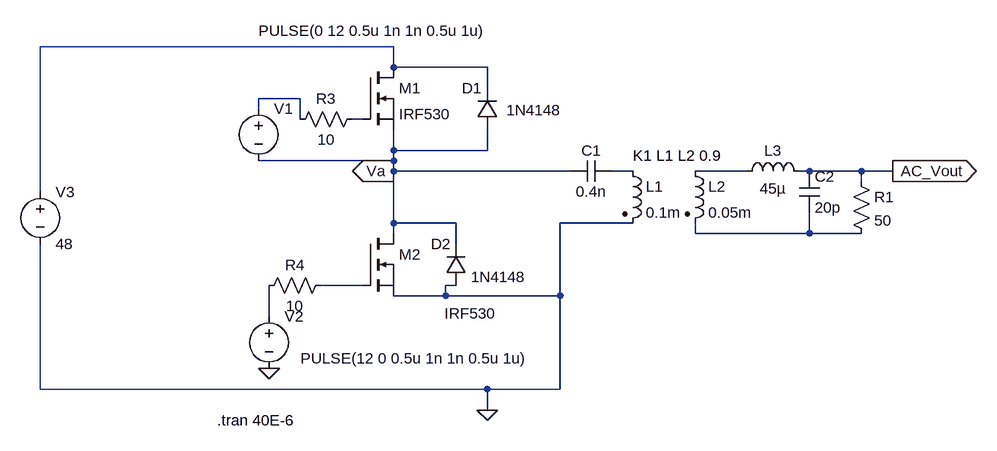
[diagram p0: schematic 1MHz_rezonansinverter.asc]
1MHz_rezonansinverter.asc, the LTspice schematic file:
Version 4
SHEET 1 1024 680
WIRE 96 -96 -448 -96
WIRE 96 -64 96 -96
WIRE 240 -64 96 -64
WIRE 240 -32 240 -64
WIRE -48 -16 -112 -16
WIRE -112 0 -112 -16
WIRE -48 16 -48 -16
WIRE 48 16 32 16
WIRE 96 64 96 32
WIRE 240 64 240 32
WIRE 240 64 96 64
WIRE 96 80 96 64
WIRE 96 80 -112 80
WIRE 96 96 96 80
WIRE 368 96 96 96
WIRE 464 96 432 96
WIRE 640 96 560 96
WIRE 736 96 720 96
WIRE 816 96 736 96
WIRE 864 96 816 96
WIRE 816 112 816 96
WIRE -448 128 -448 -96
WIRE 96 176 96 96
WIRE 192 176 96 176
WIRE 464 176 352 176
WIRE 96 192 96 176
WIRE 560 192 560 176
WIRE 736 192 736 160
WIRE 736 192 560 192
WIRE 816 192 736 192
WIRE 192 208 192 176
WIRE 48 272 -16 272
WIRE 192 272 176 272
WIRE 176 288 176 272
WIRE 176 288 96 288
WIRE 352 288 352 176
WIRE 352 288 176 288
WIRE -96 320 -96 272
WIRE -448 432 -448 208
WIRE 240 432 -448 432
WIRE 352 432 352 288
WIRE 352 432 240 432
WIRE 240 464 240 432
FLAG -96 400 0
FLAG 240 464 0
FLAG 864 96 AC_Vout
IOPIN 864 96 Out
FLAG 96 96 Va
IOPIN 96 96 Out
SYMBOL ind2 448 80 R0
SYMATTR InstName L1
SYMATTR Value 0.1m
SYMATTR Type ind
SYMBOL ind2 544 80 R0
SYMATTR InstName L2
SYMATTR Value 0.05m
SYMATTR Type ind
SYMBOL cap 432 80 R90
WINDOW 0 0 32 VBottom 2
WINDOW 3 32 32 VTop 2
SYMATTR InstName C1
SYMATTR Value 0.4n
SYMBOL ind 624 112 R270
WINDOW 0 32 56 VTop 2
WINDOW 3 5 56 VBottom 2
SYMATTR InstName L3
SYMATTR Value 45µ
SYMBOL cap 720 96 R0
SYMATTR InstName C2
SYMATTR Value 20p
SYMBOL res 800 96 R0
SYMATTR InstName R1
SYMATTR Value 50
SYMBOL nmos 48 -64 R0
SYMATTR InstName M1
SYMATTR Value IRF530
SYMBOL nmos 48 192 R0
WINDOW 3 126 123 Left 2
SYMATTR Value IRF530
SYMATTR InstName M2
SYMBOL voltage -112 -16 R0
WINDOW 3 0 -104 Left 2
WINDOW 123 0 0 Left 0
WINDOW 39 0 0 Left 0
SYMATTR Value PULSE(0 12 0.5u 1n 1n 0.5u 1u)
SYMATTR InstName V1
SYMBOL voltage -96 304 R0
WINDOW 3 49 80 Left 2
WINDOW 123 0 0 Left 0
WINDOW 39 0 0 Left 0
SYMATTR Value PULSE(12 0 0.5u 1n 1n 0.5u 1u)
SYMATTR InstName V2
SYMBOL voltage -448 112 R0
WINDOW 123 0 0 Left 0
WINDOW 39 0 0 Left 0
SYMATTR InstName V3
SYMATTR Value 48
SYMBOL res 48 0 R90
WINDOW 0 0 56 VBottom 2
WINDOW 3 32 56 VTop 2
SYMATTR InstName R3
SYMATTR Value 10
SYMBOL res 0 256 R90
WINDOW 0 0 56 VBottom 2
WINDOW 3 32 56 VTop 2
SYMATTR InstName R4
SYMATTR Value 10
SYMBOL diode 256 32 R180
WINDOW 0 24 64 Left 2
WINDOW 3 -98 30 Left 2
SYMATTR InstName D1
SYMATTR Value 1N4148
SYMBOL diode 208 272 R180
WINDOW 0 24 64 Left 2
WINDOW 3 -92 13 Left 2
SYMATTR InstName D2
SYMATTR Value 1N4148
TEXT 464 72 Left 2 !K1 L1 L2 0.9
TEXT -176 480 Left 2 !.tran 40E-6

The netlist it stands for:
* 1MHz_rezonansinverter.asc
L1 N004 0 0.1m
L2 N005 N006 0.05m
C1 N004 Va 0.4n
L3 N005 AC_Vout 45µ
C2 AC_Vout N006 20p
R1 AC_Vout N006 50
M1 N001 N003 Va Va IRF530
M2 Va N007 0 0 IRF530
V1 N002 Va PULSE(0 12 0.5u 1n 1n 0.5u 1u)
V2 N008 0 PULSE(12 0 0.5u 1n 1n 0.5u 1u)
V3 N001 0 48
R3 N003 N002 10
R4 N007 N008 10
D1 Va N001 1N4148
D2 0 Va 1N4148
.model D D
.lib standard.dio
.model NMOS NMOS
.model PMOS PMOS
.lib standard.mos
K1 L1 L2 0.9
.tran 40E-6
.backanno
.end